# EasyEDA schematic SCH_batcam10_2026-05-04.json
TITLE: B.A.T.C.A.M.; REV: 1.0; Date: 2026-03-04; Sheet: 1/1; Drawn By: attackbat; Company: B.A.T. Company
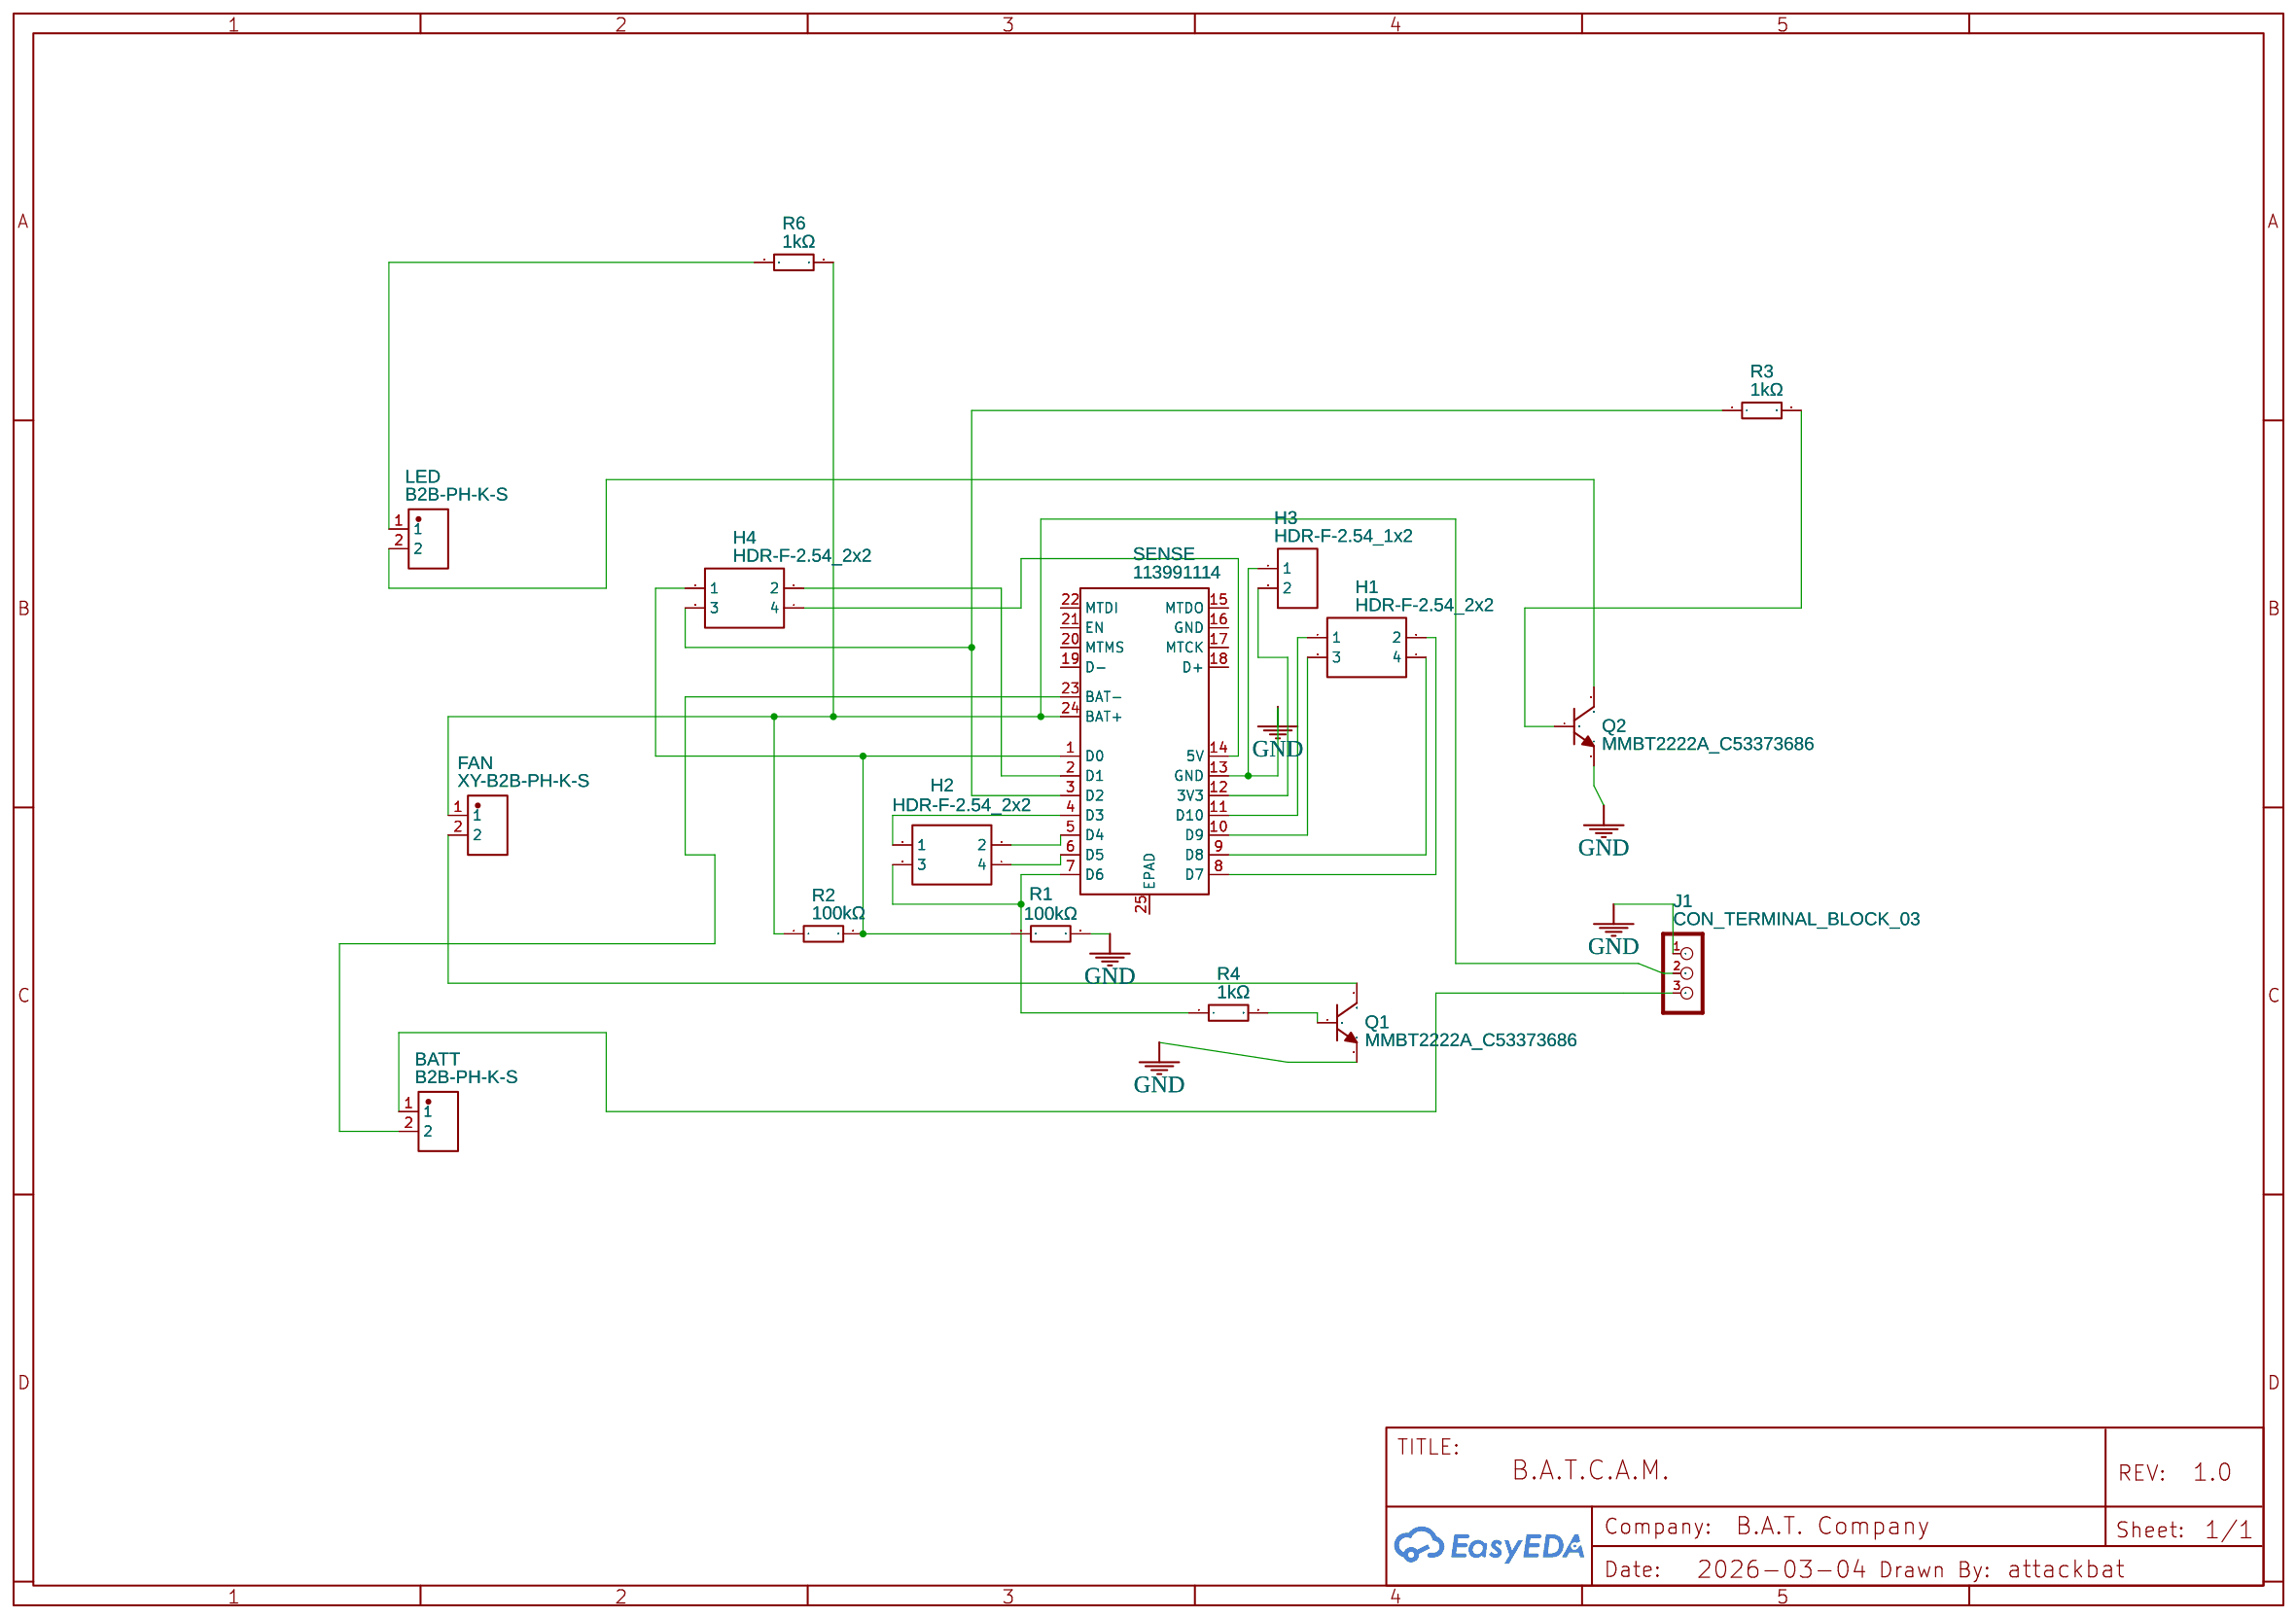
[diagram p0: schematic sheet]

## Parts
BATT  B2B-PH-K-S  [CONN-SMD_P2.00_S2B-PH-SM4-TB-LF-SN]
FAN  XY-B2B-PH-K-S  [CONN-SMD_P2.00_S2B-PH-SM4-TB-LF-SN]
H1  HDR-F-2.54_2x2  [HDR-F-2.54_2X2]
H2  HDR-F-2.54_2x2  [HDR-F-2.54_2X2]
H3  HDR-F-2.54_1x2  [HDR-F-2.54_1X2]
H4  HDR-F-2.54_2x2  [HDR-F-2.54_2X2]
J1  CON_TERMINAL_BLOCK_03  [TERMINAL_BLOCK_3P_5]
LED  B2B-PH-K-S  [CONN-SMD_P2.00_S2B-PH-SM4-TB-LF-SN]
Q1  MMBT2222A_C53373686  [AO3400A]
Q2  MMBT2222A_C53373686  [AO3400A]
R1  100kΩ  [R0805]
R2  100kΩ  [R0805]
R3  1kΩ  [R0805]
R4  1kΩ  [R0805]
R6  1kΩ  [R0805]
SENSE  113991114  [COMM-SMD_L21.1-W17.8-P2.54_113991114_XIAO-ESP32-S3]

## Library data of the parts
BATT LED = B2B-PH-K-S: Supplier: LCSC; Supplier Part: C146054; Manufacturer: JST; JLCPCB Part Class: Extended Part; Contributor: lcsc
FAN = XY-B2B-PH-K-S: Supplier: LCSC; Supplier Part: C146054; Manufacturer: XYECONN(辛译); JLCPCB Part Class: Extended Part; Contributor: lcsc
H1 H2 H4 = HDR-F-2.54_2x2: Supplier Part: C239342; Supplier: LCSC; Contributor: LCEDA_Lib
H3 = HDR-F-2.54_1x2: Supplier Part: C49661; Supplier: LCSC; Contributor: LCEDA_Lib
J1 = CON_TERMINAL_BLOCK_03: Contributor: DangerousPrototype
Q1 Q2 = MMBT2222A_C53373686: Supplier: LCSC; Supplier Part: C20917; Manufacturer: CCX(晁禾); Manufacturer Part: MMBT2222A; Contributor: lcsc; JLCPCB Part Class: Extended Part
R1 R2 = 0805W8F1003T5E_C149504: Contributor: LCSC; Supplier: LCSC; Supplier Part: C149504; Manufacturer: UNI-ROYAL(厚声); Manufacturer Part: 0805W8F1003T5E; JLCPCB Part Class: Basic Part
R3 R4 R6 = 0805W8F1001T5E: Supplier: LCSC; Manufacturer: UNI-ROYAL(厚声); Supplier Part: C17513; JLCPCB Part Class: Basic Part
SENSE = 113991114: Supplier: LCSC; Supplier Part: C20467913; Manufacturer: Seeed(矽递科技); JLCPCB Part Class: Extended Part; Contributor: lcsc

## Nets
GND: H3.1 J1.1 Q1.2(E) Q2.2(E) R1.2 SENSE.13(GND)
Net-(BATT-1): BATT.1 J1.3
Net-(BATT-2): BATT.2 SENSE.23(BAT-)
Net-(FAN-1): FAN.1 J1.2 R2.1 R6.2 SENSE.24(BAT+)
Net-(FAN-2): FAN.2 Q1.3(C)
Net-(H1-1): H1.1 SENSE.11(D10)
Net-(H1-2): H1.2 SENSE.8(D7)
Net-(H1-3): H1.3 SENSE.10(D9)
Net-(H1-4): H1.4 SENSE.9(D8)
Net-(H2-1): H2.1 SENSE.4(D3)
Net-(H2-2): H2.2 SENSE.5(D4)
Net-(H2-3): H2.3 R4.1 SENSE.7(D6)
Net-(H2-4): H2.4 SENSE.6(D5)
Net-(H3-2): H3.2 SENSE.12(3V3)
Net-(H4-1): H4.1 R1.1 R2.2 SENSE.1(D0)
Net-(H4-2): H4.2 SENSE.2(D1)
Net-(H4-3): H4.3 R3.1 SENSE.3(D2)
Net-(H4-4): H4.4 SENSE.14(5V)
Net-(LED-1): LED.1 R6.1
Net-(LED-2): LED.2 Q2.3(C)
Net-(Q1-1): Q1.1(B) R4.2
Net-(Q2-1): Q2.1(B) R3.2

Not connected (* = marked no-connect by the designer): SENSE 15(MTDO) 16(GND) 17(MTCK) 18(D+) 19(D-) 20(MTMS) 21(EN) 22(MTDI) 25(EPAD)
